# EAGLE design 119_reflector_bottom (EAGLE 9.6.0)
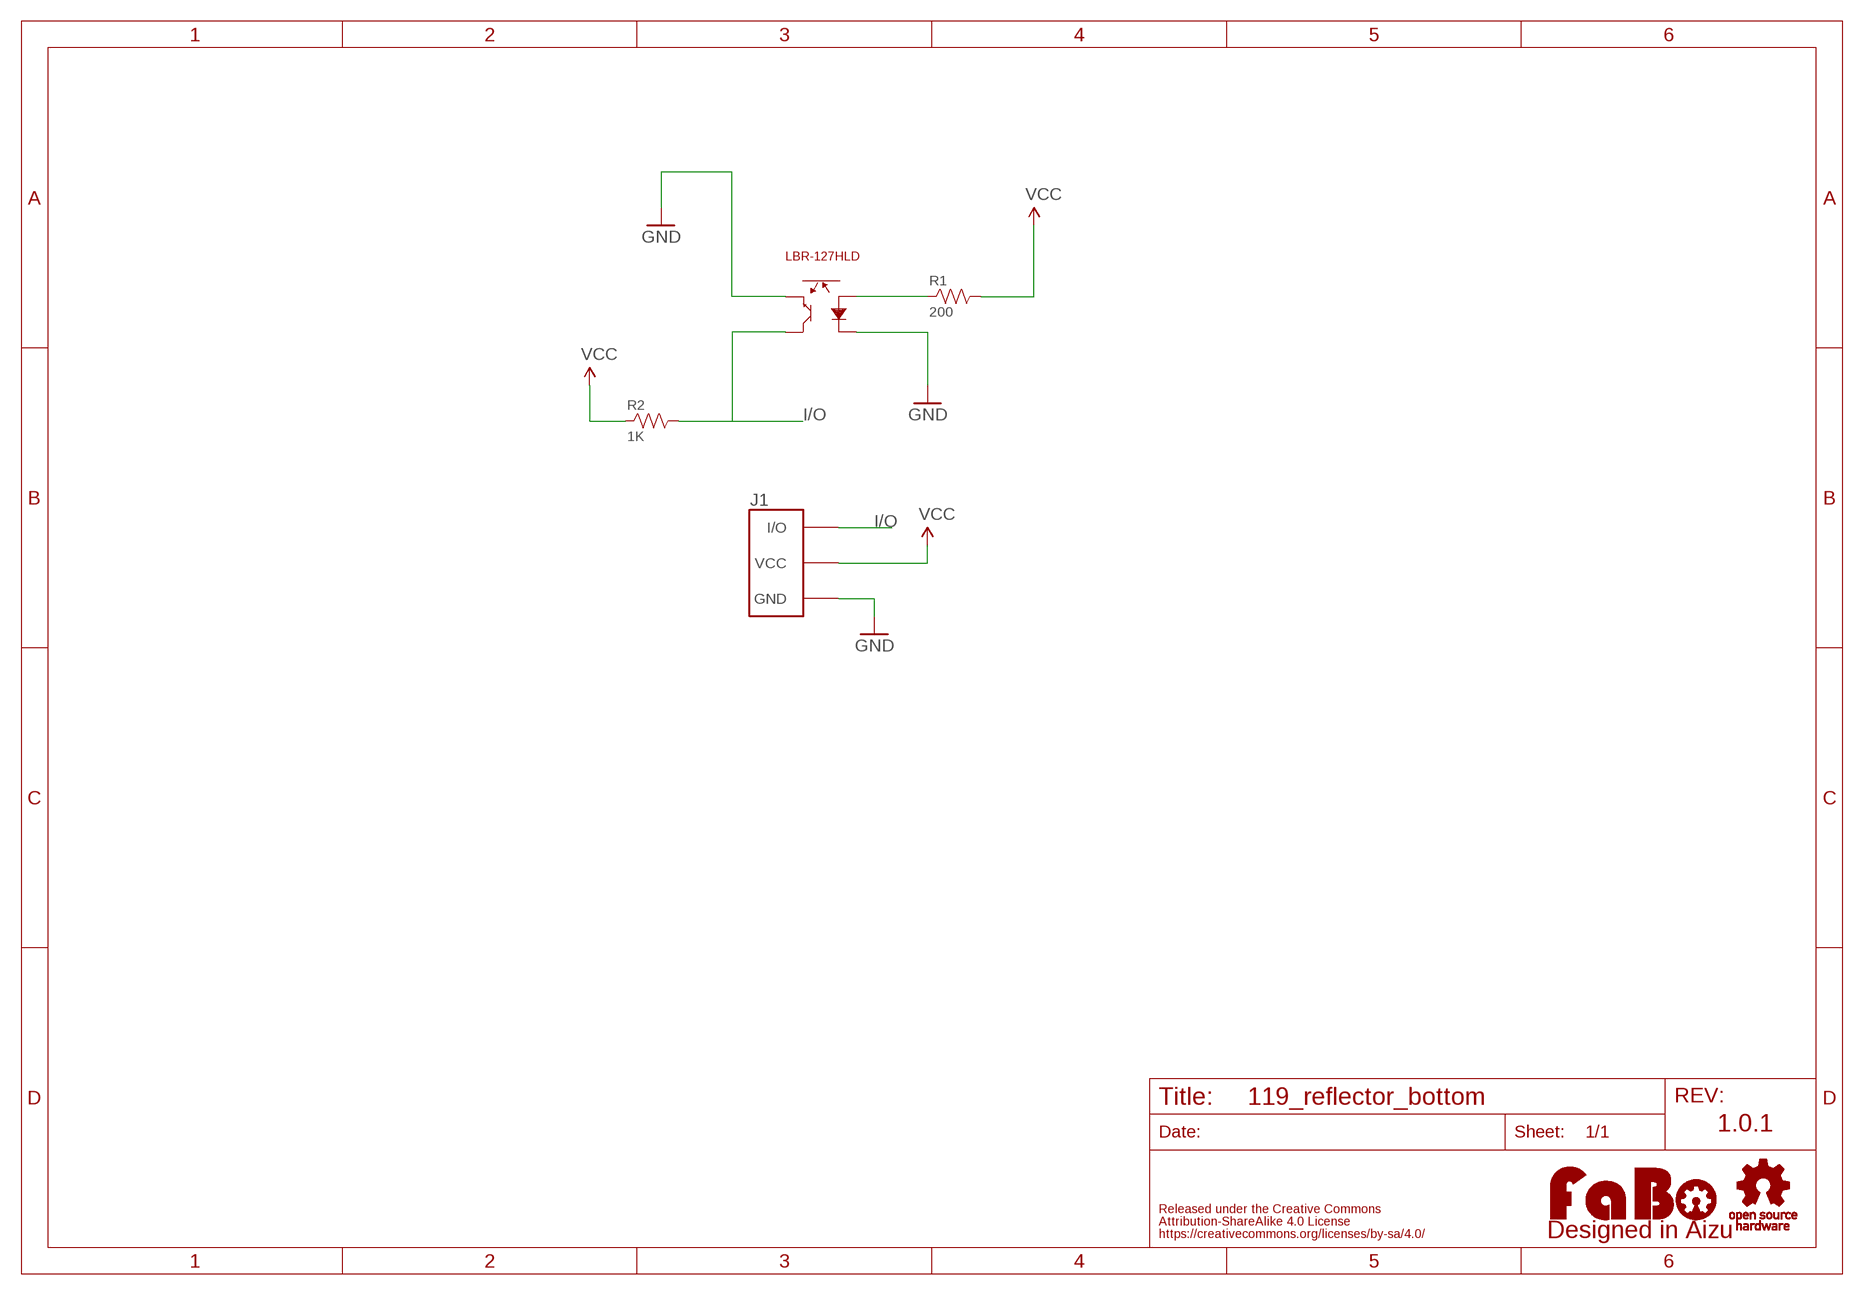
[diagram p0: schematic, sheet 1]

## Parts
J1  FABO_BRICK_3PIN  [FABO_BRICK_3PIN]
LOGO1  LOGO_FABO-M  [LOGO_FABO_M]
R  LBR-127HLDBOTTOM  [LBR-127HLD-BOTTOM]
R1  200  RESISTOR-AXL-REGULAR  [AXL-REGULAR]
R2  1K  RESISTOR-AXL-REGULAR  [AXL-REGULAR]
U$2  LOGO_OSHW-M_BOTTOM  [LOGO_OSHW_M_BOTTOM]

## Nets
GND: J1.GND R.P$2 R.P$3
I/O: J1.I/O R2.2 R.P$4
N$1: R1.1 R.P$1
VCC: J1.VCC R1.2 R2.1

## Notes on the sheet
- LBR-127HLD
- 1.0.1

## Library data of the parts
J1 = FaBo-Template:FABO_BRICK_3PIN: FaBo Brick 3pin
LOGO1 = component:LOGO_FABO
R = FaBo-Parts:LBR-127HLD
R1 R2 = FaBo-Resistors:RESISTOR: RESISTOR
U$2 = FaBo-etc:LOGO_OSHW

## Board
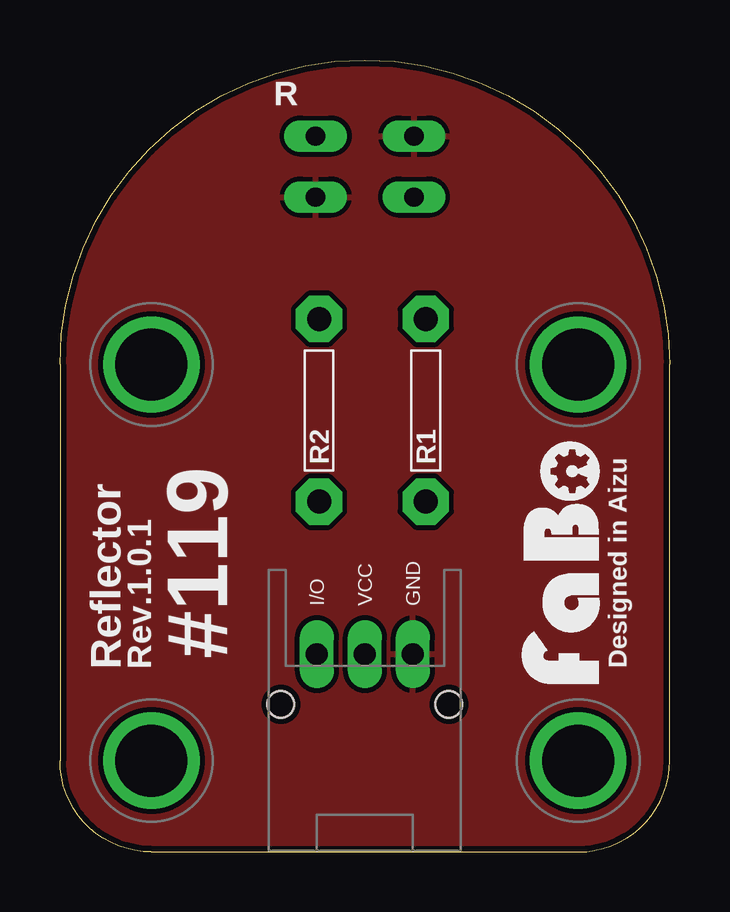
[diagram p1: board, top side]
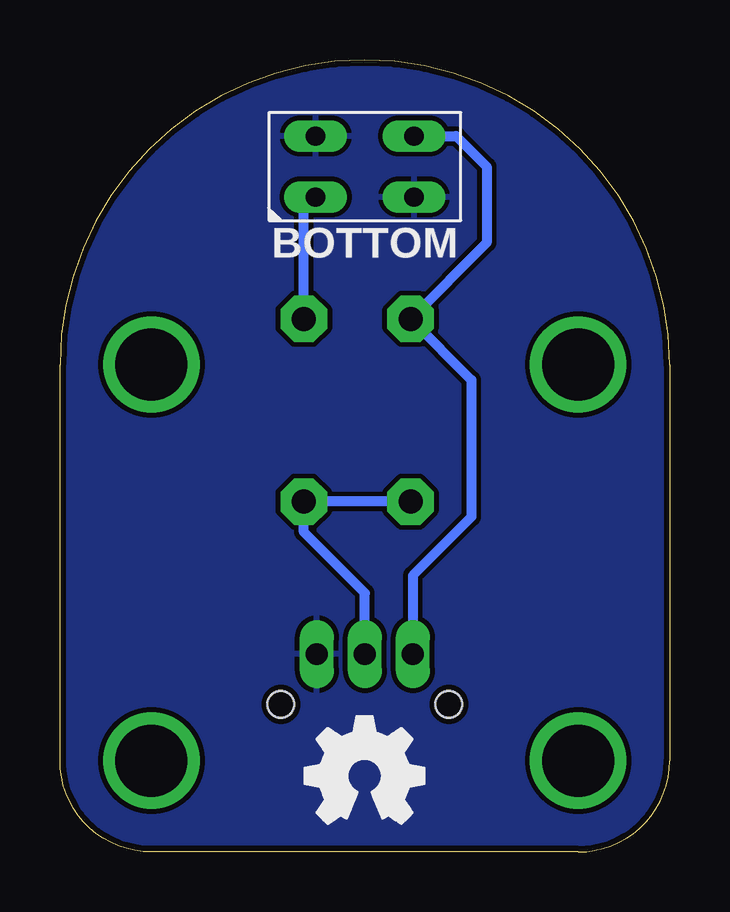
[diagram p2: board, bottom side, seen from below]

Size 25.4 x 33.02 mm. Coordinates in mm from the lower left corner, seen from the top.
Copper layers (1*16): Top 0.035mm / dielectric 1.6mm / Bottom 0.035mm
Design rules "PCBway": minimum track width 6mil, minimum drill 12mil, track to track 6mil, track to pad 6mil, pad to pad 6mil, via to via 6mil, smd to smd 6mil, copper to edge 10mil, drill to drill 10mil, minimum pad ring 10mil, minimum via ring 6mil, stop-mask expansion 2mil, vias tented up to drill 100mil, thermal gap 8mil

### Footprints (pad centres in the part's own frame; a part is rotated, then mirrored left to right if it is on the bottom)
FABO_BRICK_3PIN = drill 0.9 pad 1.422 long: GND 2,-8.255; I/O -2,-8.255; VCC 0,-8.255 | drill 3 pad 3.81: P$1 -8.89,3.81; P$2 8.89,3.81; P$3 -8.89,-12.7; P$4 8.89,-12.7 | hole 1.1: -3.5,-10.355; 3.5,-10.355
LBR-127HLD-BOTTOM = drill 0.8 long: P$1 2.05,-1.27; P$2 2.05,1.27; P$3 -2.05,-1.27; P$4 -2.05,1.27
AXL-REGULAR = drill 1 pad 1.93 octagon: 1 -3.81,0; 2 3.81,0

### Placement (x,y rotation side)
J1  12.7,16.51 0 top
LOGO1  22.86,12.06 90 top
R  12.7,28.57 0 top
R1  15.24,18.41 270 top
R2  10.79,18.41 90 top
U$2  12.7,3.17 0 top

### Tracks (layer width: path | path; a pad name or v marks a point on that pad's centre or on a via)
GND
  pour Bottom (isolate 0.203): 0,0 25.4,0 25.4,33.02 0,33.02
  pour Top (isolate 0.203): 0,0 25.4,0 25.4,33.02 0,33.02
I/O
  Bottom 0.406: R.P$4 8.89,29.84 7.62,28.57 7.62,25.4 R2.2 8.26,19.68 8.26,13.97 10.7,11.53 J1.I/O
N$1
  Bottom 0.406: R1.1 15.24,26.82 R.P$1
VCC
  Bottom 0.406: J1.VCC 12.7,10.79 15.24,13.34 R1.2 R2.1

### Text on the board
tPlace: #119 | Designed in Aizu | Reflector | Rev.1.0.1
bPlace: BOTTOM